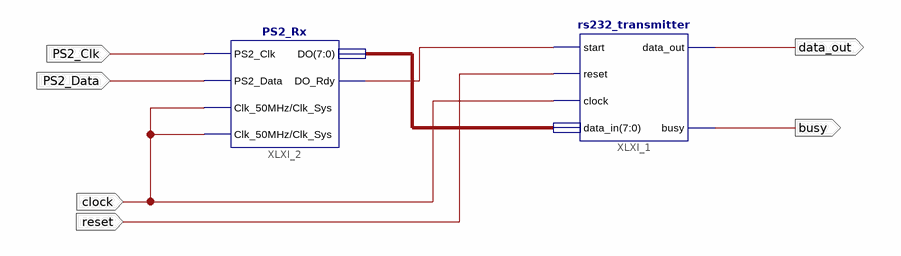
[diagram p0: schematic sheet 1]
// Xilinx ISE schematic rs23_transmitter_2_implementacja.sch (spartan3e) as structural Verilog: 2 symbols, 6 ports
module rs23_transmitter_2_implementacja (
  input  reset,
  input  clock,
  input  PS2_Clk,
  input  PS2_Data,
  output data_out,
  output busy
);

  wire start;
  wire [7:0] data_in;

  rs232_transmitter XLXI_1 (
    .start(start), .reset(reset), .clock(clock), .data_in(data_in), .data_out(data_out), .busy(busy));
  PS2_Rx XLXI_2 (
    .PS2_Clk(PS2_Clk), .PS2_Data(PS2_Data), .Clk_50MHz(clock), .Clk_Sys(clock), .DO_Rdy(start), .DO(data_in));
endmodule
